# EAGLE design MagnetometerBoard-sm-XIAO-1.0 (EAGLE 9.6.2)
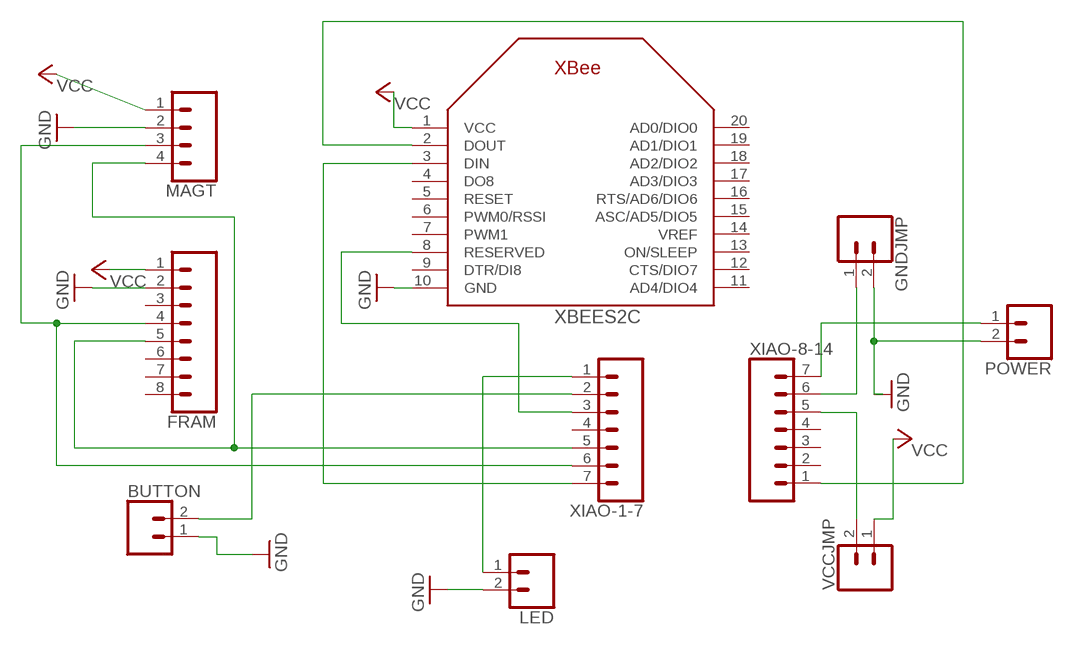
[diagram p0: schematic, sheet 1]

## Parts
BUTTON  CONN_02  [1X02]
FRAM  CONN_08"  [1X08]
GNDJMP  CONN_02  [1X02]
LED  CONN_02  [1X02]
MAGT  CONN_041X04_NO_SILK_NO_POP  [1X04_NO_SILK]
POWER  CONN_02  [1X02]
VCCJMP  CONN_02  [1X02]
XBEES2C  XBEE  [XBEE]
XIAO-1-7  CONN_07  [1X07]
XIAO-8-14  CONN_07  [1X07]

## Nets
GND: BUTTON.1 FRAM.2 GNDJMP.2 LED.2 MAGT.2 POWER.2 XBEES2C.10(GND)
N$1: VCCJMP.2 XIAO-8-14.5
N$3: XBEES2C.3(DIN) XIAO-1-7.7
N$4: POWER.1 XIAO-8-14.7
N$5: XBEES2C.8(RESERVED) XIAO-1-7.3
N$6: FRAM.4 MAGT.3 XIAO-1-7.6
N$7: FRAM.5 MAGT.4 XIAO-1-7.5
N$8: GNDJMP.1 XIAO-8-14.6
N$9: XBEES2C.2(DOUT) XIAO-8-14.1
N$10: LED.1 XIAO-1-7.1
N$11: BUTTON.2 XIAO-1-7.2
VCC: FRAM.1 MAGT.1 VCCJMP.1 XBEES2C.1(VCC)
Unconnected: FRAM.3 FRAM.6 FRAM.7 FRAM.8 XBEES2C.4(DO8) XBEES2C.5(RESET) XBEES2C.6(PWM0/RSSI) XBEES2C.7(PWM1) XBEES2C.9(DTR/DI8) XBEES2C.11(AD4/DIO4) XBEES2C.12(CTS/DIO7) XBEES2C.13(ON/SLEEP) XBEES2C.14(VREF) XBEES2C.15(ASC/AD5/DIO5) XBEES2C.16(RTS/AD6/DIO6) XBEES2C.17(AD3/DIO3) XBEES2C.18(AD2/DIO2) XBEES2C.19(AD1/DIO1) XBEES2C.20(AD0/DIO0) XIAO-1-7.4 XIAO-8-14.2 XIAO-8-14.3 XIAO-8-14.4

## Library data of the parts
BUTTON GNDJMP LED POWER VCCJMP = SparkFun-Connectors:CONN_02: Multi connection point. Often used as Generic Header-pin footprint for 0.1 inch spaced/style header connections On any of the 0.1 inch spaced packages, you can populate with these: Break Away Headers - Straight <https://www.sparkfun.com/products/116> (PRT-00116) Break Away Male Headers - Right Angle <https://www.sparkfun.com/products/553> (PRT-00553) Female Headers <https://www.sparkfun.com/products/115> (PRT-00115) Break Away Headers - Machine Pin <https://www.sparkfun.com/products/117> (PRT-00117) Break Away Female Headers - Swiss Machine Pin <https://www.sparkfun.com/products/743> (PRT-00743) For SCREWTERMINALS and SPRING TERMINALS visit here: Screw Terimnals on SparkFun.com <https://www.sparkfun.com/search/results?term=Screw+Terminals> (5mm/3.5mm/2.54mm spacing) This device is also useful as a general connection point to wire up your design to another part of your project. Our various solder wires solder well into these plated through hole pads. Hook-Up Wire - Assortment (Stranded, 22 AWG) <https://www.sparkfun.com/products/11375> (PRT-11375) Hook-Up Wire - Assortment (Solid Core, 22 AWG) <https://www.sparkfun.com/products/11367> (PRT-11367) View the entire wire category on our website here <https://www.sparkfun.com/categories/141> Special notes: Molex polarized connector foot print use with: PRT-08233 with associated crimp pins and housings. 2.54_SCREWTERM for use with PRT-10571. 3.5mm Screw Terminal footprints for PRT-08084 5mm Screw Terminal footprints for use with PRT-08432
FRAM = SparkFun-Connectors:CONN_08: Multi connection point. Often used as Generic Header-pin footprint for 0.1 inch spaced/style header connections On any of the 0.1 inch spaced packages, you can populate with these: Break Away Headers - Straight <https://www.sparkfun.com/products/116> (PRT-00116) Break Away Male Headers - Right Angle <https://www.sparkfun.com/products/553> (PRT-00553) Female Headers <https://www.sparkfun.com/products/115> (PRT-00115) Break Away Headers - Machine Pin <https://www.sparkfun.com/products/117> (PRT-00117) Break Away Female Headers - Swiss Machine Pin <https://www.sparkfun.com/products/743> (PRT-00743) Arduino Stackable Header - 8 Pin <https://www.sparkfun.com/products/9279> (PRT-09279) For SCREWTERMINALS and SPRING TERMINALS visit here: Screw Terimnals on SparkFun.com <https://www.sparkfun.com/search/results?term=Screw+Terminals> (5mm/3.5mm/2.54mm spacing) This device is also useful as a general connection point to wire up your design to another part of your project. Our various solder wires solder well into these plated through hole pads. Hook-Up Wire - Assortment (Stranded, 22 AWG) <https://www.sparkfun.com/products/11375> (PRT-11375) Hook-Up Wire - Assortment (Solid Core, 22 AWG) <https://www.sparkfun.com/products/11367> (PRT-11367) View the entire wire category on our website here <https://www.sparkfun.com/categories/141> Special notes: Molex polarized connector foot print use with SKU : PRT-08231 with associated crimp pins and housings. 1MM SMD Version SKU: PRT-10208 NOTES ON THE VARIANTS LOCK and LOCK_LONGPADS... This footprint was designed to help hold the alignment of a through-hole component (i.e. 6-pin header) while soldering it into place. You may notice that each hole has been shifted either up or down by 0.005 of an inch from it's more standard position (which is a perfectly straight line). This slight alteration caused the pins (the squares in the middle) to touch the edges of the holes. Because they are alternating, it causes a "brace" to hold the component in place. 0.005 has proven to be the perfect amount of "off-center" position when using our standard breakaway headers. Although looks a little odd when you look at the bare footprint, once you have a header in there, the alteration is very hard to notice. Also,if you push a header all the way into place, it is covered up entirely on the bottom side.; PROD_ID: CONN-08438
MAGT = SparkFun-Connectors:CONN_04: Multi connection point. Often used as Generic Header-pin footprint for 0.1 inch spaced/style header connections On any of the 0.1 inch spaced packages, you can populate with these: Break Away Headers - Straight <https://www.sparkfun.com/products/116> (PRT-00116) Break Away Male Headers - Right Angle <https://www.sparkfun.com/products/553> (PRT-00553) Female Headers <https://www.sparkfun.com/products/115> (PRT-00115) Break Away Headers - Machine Pin <https://www.sparkfun.com/products/117> (PRT-00117) Break Away Female Headers - Swiss Machine Pin <https://www.sparkfun.com/products/743> (PRT-00743) For SCREWTERMINALS and SPRING TERMINALS visit here: Screw Terimnals on SparkFun.com <https://www.sparkfun.com/search/results?term=Screw+Terminals> (5mm/3.5mm/2.54mm spacing) This device is also useful as a general connection point to wire up your design to another part of your project. Our various solder wires solder well into these plated through hole pads. Hook-Up Wire - Assortment (Stranded, 22 AWG) <https://www.sparkfun.com/products/11375> (PRT-11375) Hook-Up Wire - Assortment (Solid Core, 22 AWG) <https://www.sparkfun.com/products/11367> (PRT-11367) View the entire wire category on our website here <https://www.sparkfun.com/categories/141> Special notes: Molex polarized connector foot print use with SKU : PRT-08231 with associated crimp pins and housings. 1MM SMD Version SKU: PRT-10208
XBEES2C = adafruit:XBEE; SPICEPREFIX: X
XIAO-1-7 XIAO-8-14 = SparkFun-Connectors:CONN_07: Multi connection point. Often used as Generic Header-pin footprint for 0.1 inch spaced/style header connections On any of the 0.1 inch spaced packages, you can populate with these: Break Away Headers - Straight <https://www.sparkfun.com/products/116> (PRT-00116) Break Away Male Headers - Right Angle <https://www.sparkfun.com/products/553> (PRT-00553) Female Headers <https://www.sparkfun.com/products/115> (PRT-00115) Break Away Headers - Machine Pin <https://www.sparkfun.com/products/117> (PRT-00117) Break Away Female Headers - Swiss Machine Pin <https://www.sparkfun.com/products/743> (PRT-00743) For SCREWTERMINALS and SPRING TERMINALS visit here: Screw Terimnals on SparkFun.com <https://www.sparkfun.com/search/results?term=Screw+Terminals> (5mm/3.5mm/2.54mm spacing) This device is also useful as a general connection point to wire up your design to another part of your project. Our various solder wires solder well into these plated through hole pads. Hook-Up Wire - Assortment (Stranded, 22 AWG) <https://www.sparkfun.com/products/11375> (PRT-11375) Hook-Up Wire - Assortment (Solid Core, 22 AWG) <https://www.sparkfun.com/products/11367> (PRT-11367) View the entire wire category on our website here <https://www.sparkfun.com/categories/141> Special notes: Molex polarized connector foot print use with SKU : PRT-08231 with associated crimp pins and housings. 1MM SMD Version SKU: PRT-10208 NOTES ON THE VARIANTS LOCK and LOCK_LONGPADS... This footprint was designed to help hold the alignment of a through-hole component (i.e. 6-pin header) while soldering it into place. You may notice that each hole has been shifted either up or down by 0.005 of an inch from it's more standard position (which is a perfectly straight line). This slight alteration caused the pins (the squares in the middle) to touch the edges of the holes. Because they are alternating, it causes a "brace" to hold the component in place. 0.005 has proven to be the perfect amount of "off-center" position when using our standard breakaway headers. Although looks a little odd when you look at the bare footprint, once you have a header in there, the alteration is very hard to notice. Also,if you push a header all the way into place, it is covered up entirely on the bottom side.

## Net classes
0 default: width 0.305 mm, drill 0.508 mm, clearance 0.508 mm

## Board
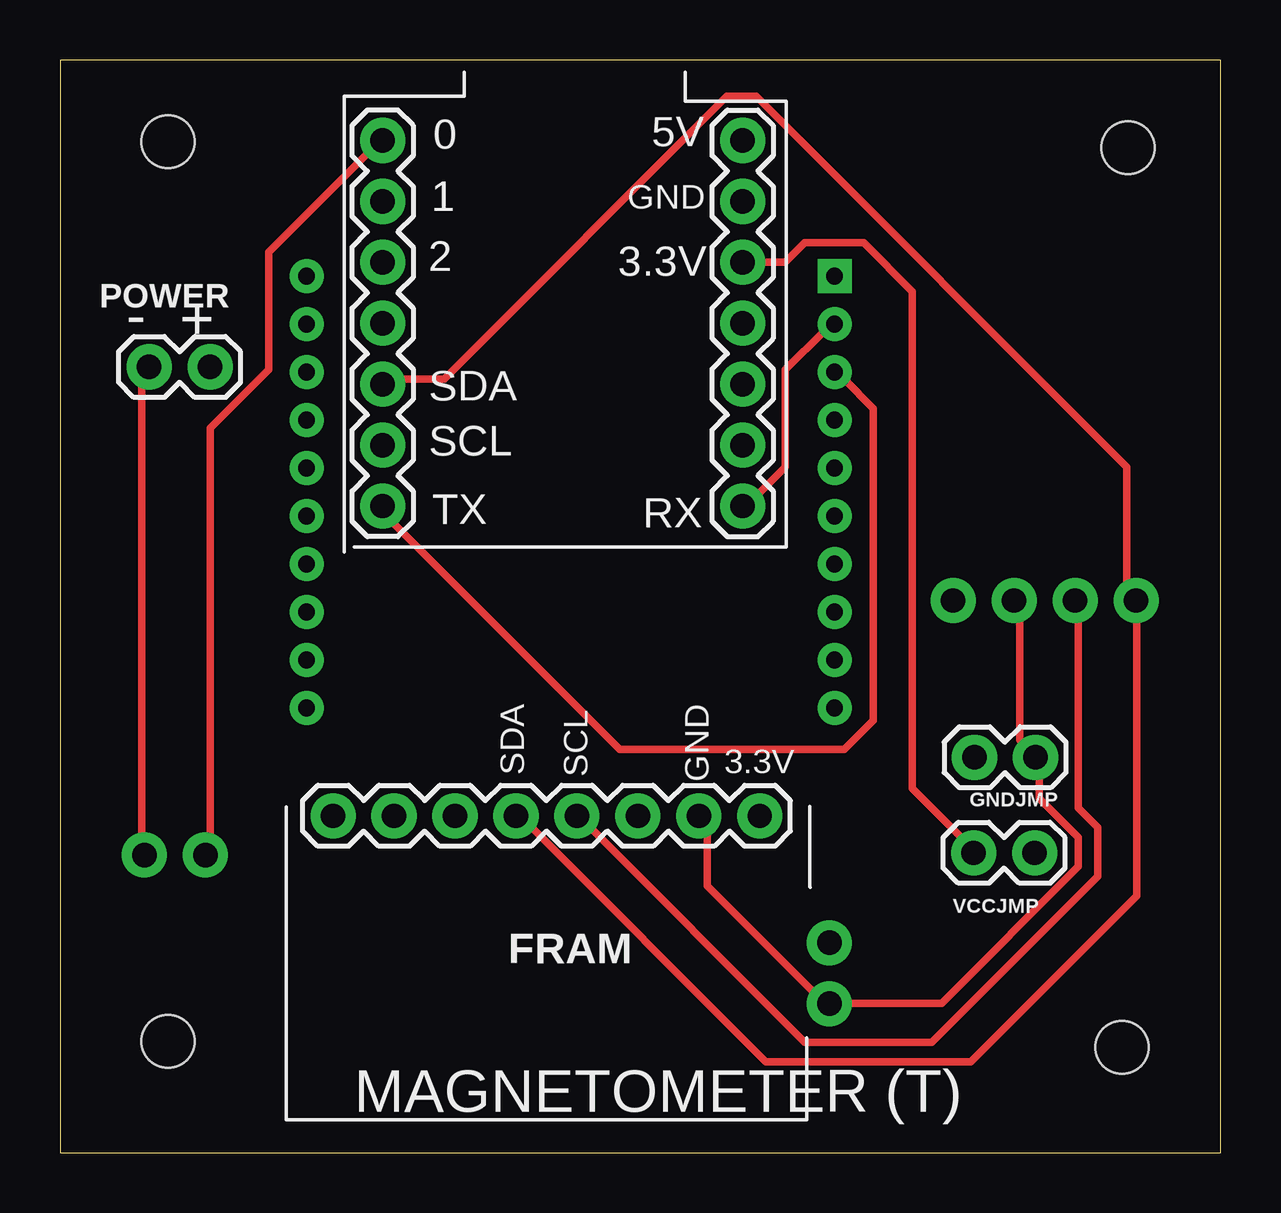
[diagram p1: board, top side]
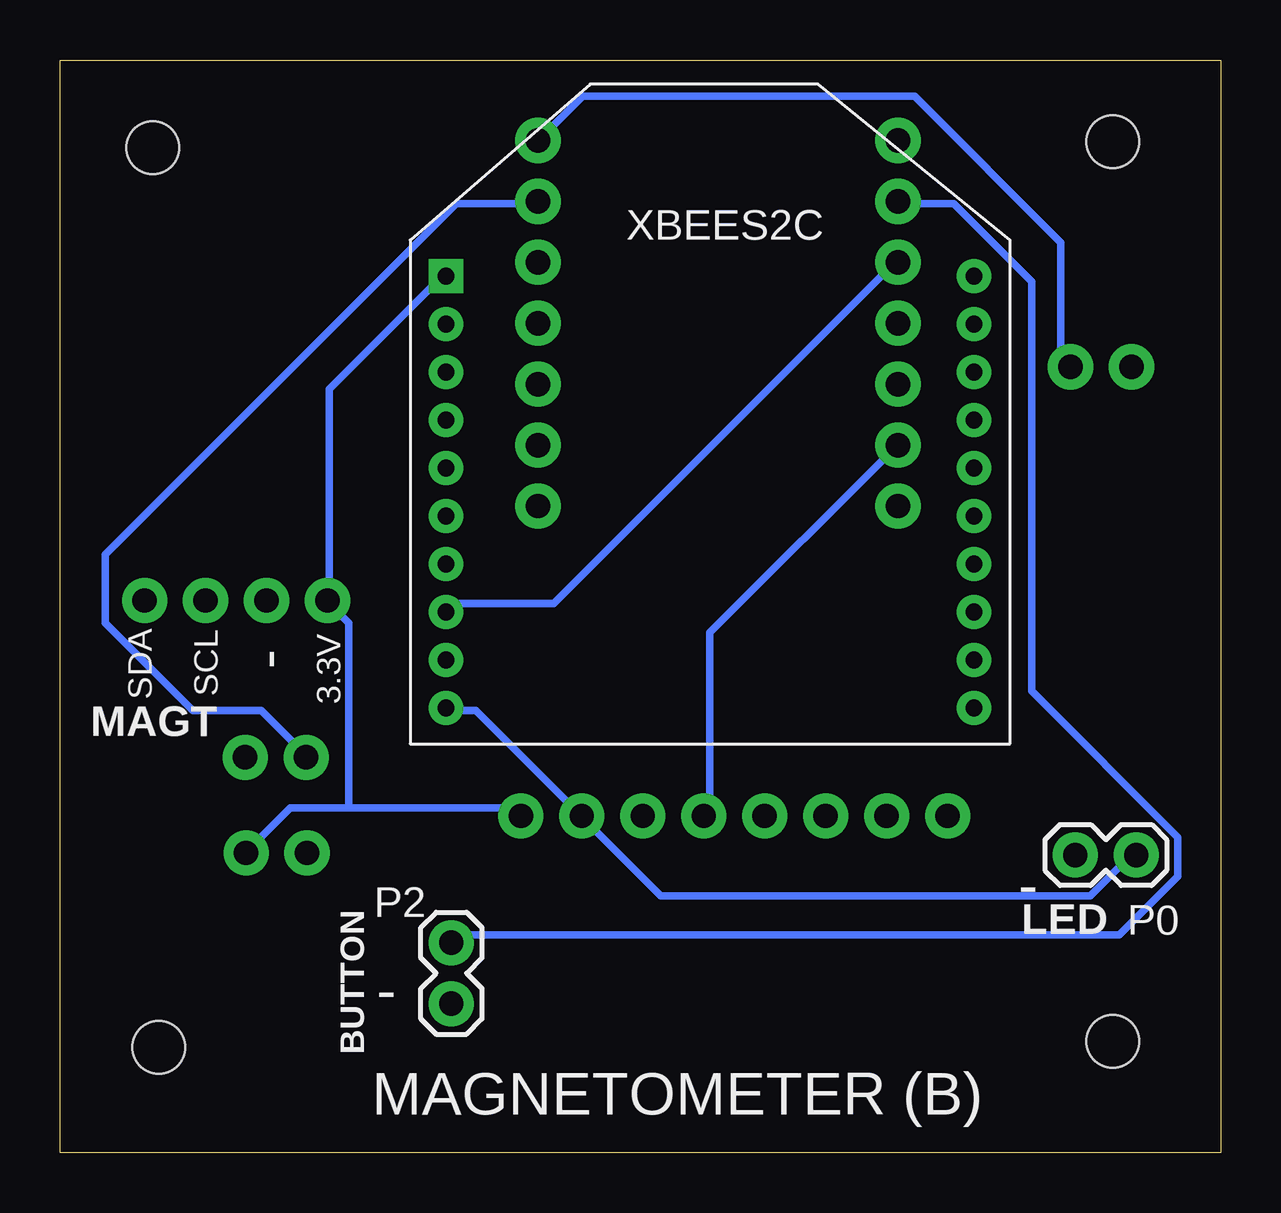
[diagram p2: board, bottom side, seen from below]

Size 48.36 x 45.56 mm. Coordinates in mm from the lower left corner, seen from the top.
Outline: 0,0 48.36,0 48.36,45.56 0,45.56 0,0
Copper layers (1*16): Top 0.035mm / dielectric 1.5mm / Bottom 0.035mm
Design rules "default": minimum track width 6mil, minimum drill 0.35mm, track to track 6mil, track to pad 6mil, pad to pad 6mil, via to via 6mil, smd to smd 6mil, copper to edge 40mil, drill to drill 6mil, minimum pad ring 10mil, minimum via ring 8mil, stop-mask expansion 4mil, vias tented up to drill 0mil, thermal gap 10mil
Holes 2.2 mm at 4.5,42.15 44.5,41.9 44.25,4.4 4.5,4.65

### Footprints (pad centres in the part's own frame; a part is rotated, then mirrored left to right if it is on the bottom)
1X02 = drill 1.016 pad 1.88: 1 0,0; 2 2.54,0
1X08 = drill 1.016 pad 1.88: 1 0,0; 2 2.54,0; 3 5.08,0; 4 7.62,0; 5 10.16,0; 6 12.7,0; 7 15.24,0; 8 17.78,0
1X04_NO_SILK = drill 1.016 pad 1.88: 1 0,0; 2 2.54,0; 3 5.08,0; 4 7.62,0
XBEE = drill 0.7 pad 1.422 square: 1 -11,5.5 | drill 0.7 pad 1.422: 2 -11,3.5; 3 -11,1.5; 4 -11,-0.5; 5 -11,-2.5; 6 -11,-4.5; 7 -11,-6.5; 8 -11,-8.5; 9 -11,-10.5; 10 -11,-12.5; 11 11,-12.5; 12 11,-10.5; 13 11,-8.5; 14 11,-6.5; 15 11,-4.5; 16 11,-2.5; 17 11,-0.5; 18 11,1.5; 19 11,3.5; 20 11,5.5
1X07 = drill 1.016 pad 1.88: 1 0,0; 2 2.54,0; 3 5.08,0; 4 7.62,0; 5 10.16,0; 6 12.7,0; 7 15.24,0

### Placement (x,y rotation side)
BUTTON  32.06,6.23 90 bottom
FRAM  29.16,14.05 180 top
GNDJMP  38.1,16.49 0 top
LED  6.06,12.42 0 bottom
MAGT  37.22,23.03 180 bottom
POWER  6.25,32.77 180 top
VCCJMP  40.61,12.51 180 top
XBEES2C  21.27,31.05 0 bottom
XIAO-1-7  13.45,42.21 270 top
XIAO-8-14  28.45,26.97 90 top

### Tracks (layer width: path | path; a pad name or v marks a point on that pad's centre or on a via)
GND
  Top 0.305: LED.2 3.41,12.75 3.41,32.66 POWER.2 | MAGT.2 39.98,22.91 39.98,17.22 40.39,16.81 GNDJMP.2 40.8,16.41 40.8,14.78 42.42,13.16 42.42,11.94 36.73,6.25 32.26,6.25 BUTTON.1 31.85,6.25 26.98,11.13 26.98,13.97 FRAM.2
  Bottom 0.305: XBEES2C.10 32.26,18.44 31.04,18.44 26.98,14.38 FRAM.2 26.57,13.97 23.32,10.72 5.44,10.72 3.81,12.34 LED.2
N$1
  Top 0.305: XIAO-8-14.5 28.6,37.13 30.23,37.13 31.04,37.95 33.48,37.95 35.51,35.92 35.51,15.19 37.95,12.75 VCCJMP.2
N$3
  Top 0.305: XBEES2C.3 32.67,32.26 33.89,31.04 33.89,18.03 32.67,16.81 23.32,16.81 13.57,26.57 XIAO-1-7.7
N$4
  Bottom 0.305: POWER.1 6.66,33.07 6.66,37.95 12.75,44.04 26.57,44.04 28.2,42.42 XIAO-8-14.7
N$5
  Bottom 0.305: XBEES2C.8 32.26,22.91 27.79,22.91 13.57,37.13 XIAO-1-7.3
N$6
  Top 0.305: MAGT.3 42.42,22.91 42.42,14.38 43.23,13.56 43.23,11.53 36.33,4.62 31.04,4.62 21.69,13.97 FRAM.4
  Bottom 0.305: XIAO-1-7.6 13.57,29.41 21.29,21.69 21.29,14.38 FRAM.4
N$7
  Top 0.305: XIAO-1-7.5 13.57,32.26 16.01,32.26 27.79,44.04 29.01,44.04 44.45,28.6 44.45,23.32 MAGT.4 44.86,22.91 44.86,10.72 37.95,3.81 29.42,3.81 19.26,13.97 FRAM.5
N$8
  Bottom 0.305: XIAO-8-14.6 28.6,39.57 31.85,39.57 46.48,24.94 46.48,22.1 42.83,18.44 39.98,18.44 38.36,16.81 GNDJMP.1
N$9
  Top 0.305: XBEES2C.2 32.26,34.29 31.85,34.29 30.23,32.66 30.23,28.6 28.6,26.98 XIAO-8-14.1
N$10
  Top 0.305: LED.1 6.25,12.75 6.25,30.23 8.69,32.66 8.69,37.54 13.16,42.01 XIAO-1-7.1
N$11
  Bottom 0.305: XIAO-1-7.2 13.16,39.57 11.13,39.57 7.88,36.32 7.88,19.25 1.78,13.16 1.78,11.53 4.22,9.09 31.85,9.09 BUTTON.2
VCC
  Bottom 0.305: 36.33,14.38 29.42,14.38 FRAM.1 | 36.33,14.38 38.76,14.38 40.39,12.75 VCCJMP.1 | XBEES2C.1 32.67,36.32 37.14,31.85 37.14,23.32 MAGT.1 37.14,22.91 36.33,22.1 36.33,14.38

### Text on the board
tNames: 0 | 5V | 1 | GND | 2 | 3.3V | - | + | SDA | SCL | TX | RX | GND | 3.3V | SDA | SCL | MAGNETOMETER (T)
bNames: 3.3V | - | SCL | SDA | - | P2 | P0 | - | MAGNETOMETER (B)